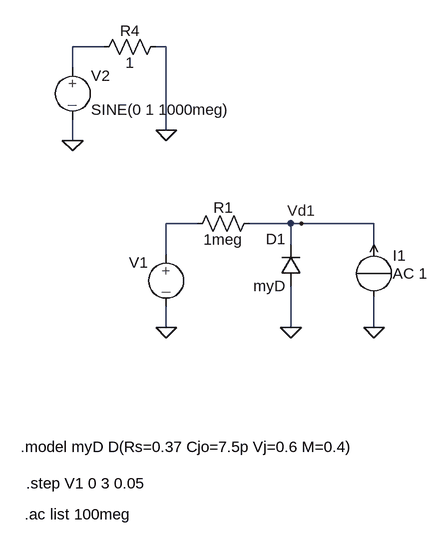
[diagram p0: schematic CapDiode.asc]
CapDiode.asc, the LTspice schematic file:
Version 4
SHEET 1 880 680
WIRE 128 -368 80 -368
WIRE 224 -368 208 -368
WIRE 80 -336 80 -368
WIRE 224 -240 224 -368
WIRE 80 -224 80 -256
WIRE 272 -96 224 -96
WIRE 416 -96 352 -96
WIRE 432 -96 416 -96
WIRE 544 -96 432 -96
WIRE 416 -64 416 -96
WIRE 544 -64 544 -96
WIRE 224 -48 224 -96
WIRE 224 64 224 32
WIRE 416 64 416 0
WIRE 544 64 544 16
FLAG 224 -240 0
FLAG 80 -224 0
FLAG 416 64 0
FLAG 224 64 0
FLAG 544 64 0
FLAG 432 -96 Vd1
SYMBOL source-V 80 -352 R0
WINDOW 123 0 0 Left 0
WINDOW 39 0 0 Left 0
SYMATTR InstName V2
SYMATTR Value SINE(0 1 1000meg)
SYMBOL res 112 -352 R270
WINDOW 0 25 56 VTop 0
WINDOW 3 7 56 VBottom 0
SYMATTR InstName R4
SYMATTR Value 1
SYMBOL diode 432 0 R180
WINDOW 0 24 72 Left 0
WINDOW 3 24 0 Left 0
SYMATTR InstName D1
SYMATTR Value myD
SYMBOL res 256 -80 R270
WINDOW 0 25 56 VTop 0
WINDOW 3 7 56 VBottom 0
SYMATTR InstName R1
SYMATTR Value 1meg
SYMBOL source-V 224 -64 M0
WINDOW 123 0 0 Left 0
WINDOW 39 0 0 Left 0
SYMATTR InstName V1
SYMATTR Value ""
SYMBOL source-I 544 -64 R0
WINDOW 123 29 45 Left 0
WINDOW 39 0 0 Left 0
SYMATTR InstName I1
SYMATTR Value ""
SYMATTR Value2 AC 1
TEXT 0 248 Left 0 !.model myD D(Rs=0.37 Cjo=7.5p Vj=0.6 M=0.4)
TEXT 8 304 Left 0 !.step V1 0 3 0.05
TEXT 6 352 Left 0 !.ac list 100meg

The netlist it stands for:
* CapDiode.asc
V2 N001 0 SINE(0 1 1000meg)
R4 N001 0 1
D1 0 Vd1 myD
R1 N002 Vd1 1meg
V1 N002 0
I1 0 Vd1 AC 1
.model D D
.lib standard.dio
.model myD D(Rs=0.37 Cjo=7.5p Vj=0.6 M=0.4)
.step V1 0 3 0.05
.ac list 100meg
.backanno
.end